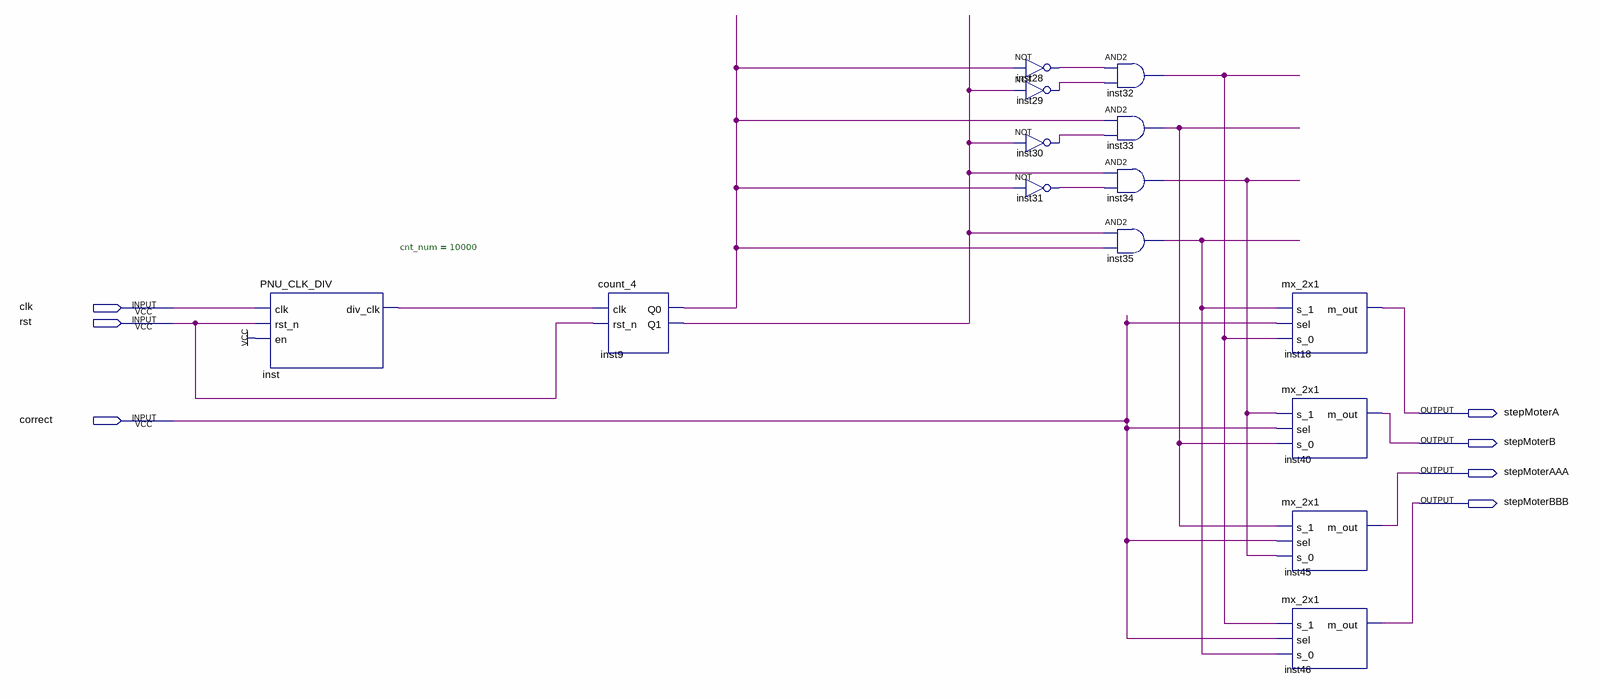
[diagram p0: schematic sheet]
// Quartus schematic step_moter.bdf as structural Verilog: 14 symbols, 7 pins
module step_moter (
  input  clk,
  input  rst,
  input  correct,
  output stepMoterA,
  output stepMoterB,
  output stepMoterAAA,
  output stepMoterBBB
);

  wire inst9_q0, inst9_q1, inst28_out, inst29_out, inst30_out, inst31_out, inst32_out, inst33_out,
       inst34_out, inst35_out, inst_div_clk;

  PNU_CLK_DIV #(.cnt_num(10000)) inst (.clk(clk), .rst_n(rst), .en(1'b1), .div_clk(inst_div_clk));
  count_4 inst9 (.clk(inst_div_clk), .rst_n(rst), .Q0(inst9_q0), .Q1(inst9_q1));
  not inst28 (inst28_out, inst9_q0);
  not inst29 (inst29_out, inst9_q1);
  not inst30 (inst30_out, inst9_q1);
  not inst31 (inst31_out, inst9_q0);
  and inst32 (inst32_out, inst28_out, inst29_out);
  and inst33 (inst33_out, inst9_q0, inst30_out);
  and inst34 (inst34_out, inst9_q1, inst31_out);
  and inst35 (inst35_out, inst9_q1, inst9_q0);
  mx_2x1 inst18 (.s_1(inst35_out), .sel(correct), .s_0(inst32_out), .m_out(stepMoterA));
  mx_2x1 inst40 (.s_1(inst34_out), .sel(correct), .s_0(inst33_out), .m_out(stepMoterB));
  mx_2x1 inst45 (.s_1(inst33_out), .sel(correct), .s_0(inst34_out), .m_out(stepMoterAAA));
  mx_2x1 inst46 (.s_1(inst32_out), .sel(correct), .s_0(inst35_out), .m_out(stepMoterBBB));
endmodule
